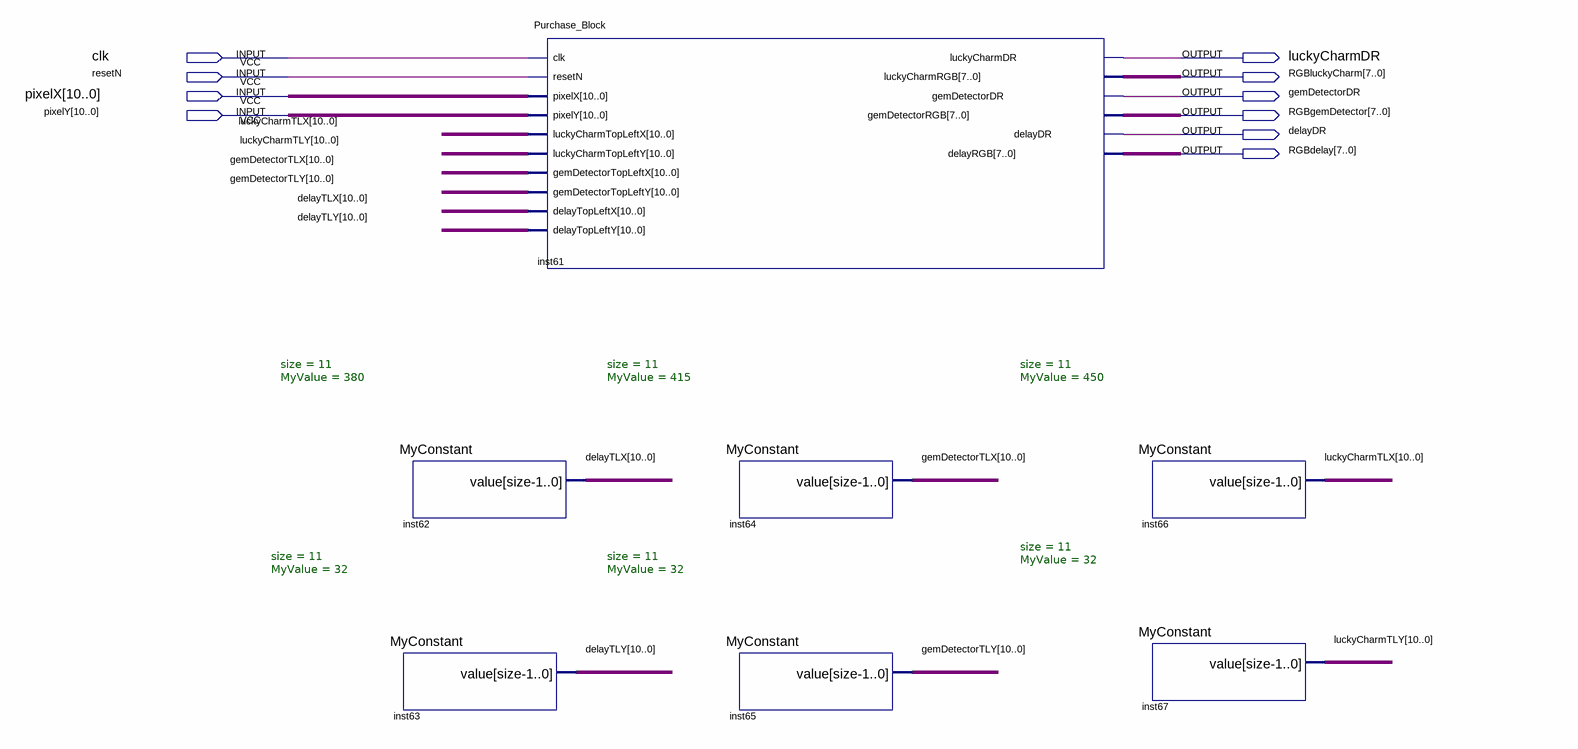
[diagram p0: schematic sheet]
// Quartus schematic Purchase_Top.bdf as structural Verilog: 7 symbols, 10 pins
module Purchase_Top (
  input  clk,
  input  resetN,
  input  [10:0] pixelX,
  input  [10:0] pixelY,
  output luckyCharmDR,
  output [7:0] RGBluckyCharm,
  output gemDetectorDR,
  output [7:0] RGBgemDetector,
  output delayDR,
  output [7:0] RGBdelay
);

  wire [10:0] delayTLX, delayTLY, gemDetectorTLX, gemDetectorTLY, luckyCharmTLX, luckyCharmTLY;

  MyConstant #(.size(11), .MyValue(380)) inst62 (.value(delayTLX));
  MyConstant #(.size(11), .MyValue(32)) inst63 (.value(delayTLY));
  Purchase_Block inst61 (
    .clk(clk), .resetN(resetN), .pixelX(pixelX), .pixelY(pixelY), .luckyCharmTopLeftX(luckyCharmTLX),
    .luckyCharmTopLeftY(luckyCharmTLY), .gemDetectorTopLeftX(gemDetectorTLX),
    .gemDetectorTopLeftY(gemDetectorTLY), .delayTopLeftX(delayTLX), .delayTopLeftY(delayTLY),
    .luckyCharmDR(luckyCharmDR), .luckyCharmRGB(RGBluckyCharm), .gemDetectorDR(gemDetectorDR),
    .gemDetectorRGB(RGBgemDetector), .delayDR(delayDR), .delayRGB(RGBdelay));
  MyConstant #(.size(11), .MyValue(415)) inst64 (.value(gemDetectorTLX));
  MyConstant #(.size(11), .MyValue(32)) inst65 (.value(gemDetectorTLY));
  MyConstant #(.size(11), .MyValue(450)) inst66 (.value(luckyCharmTLX));
  MyConstant #(.size(11), .MyValue(32)) inst67 (.value(luckyCharmTLY));
endmodule
